# EAGLE design ControllerESP32 (EAGLE 7.7.0)
CNAME: NetStepper; CREVISION: 0.1; DESIGNER: Joël Gähwiler
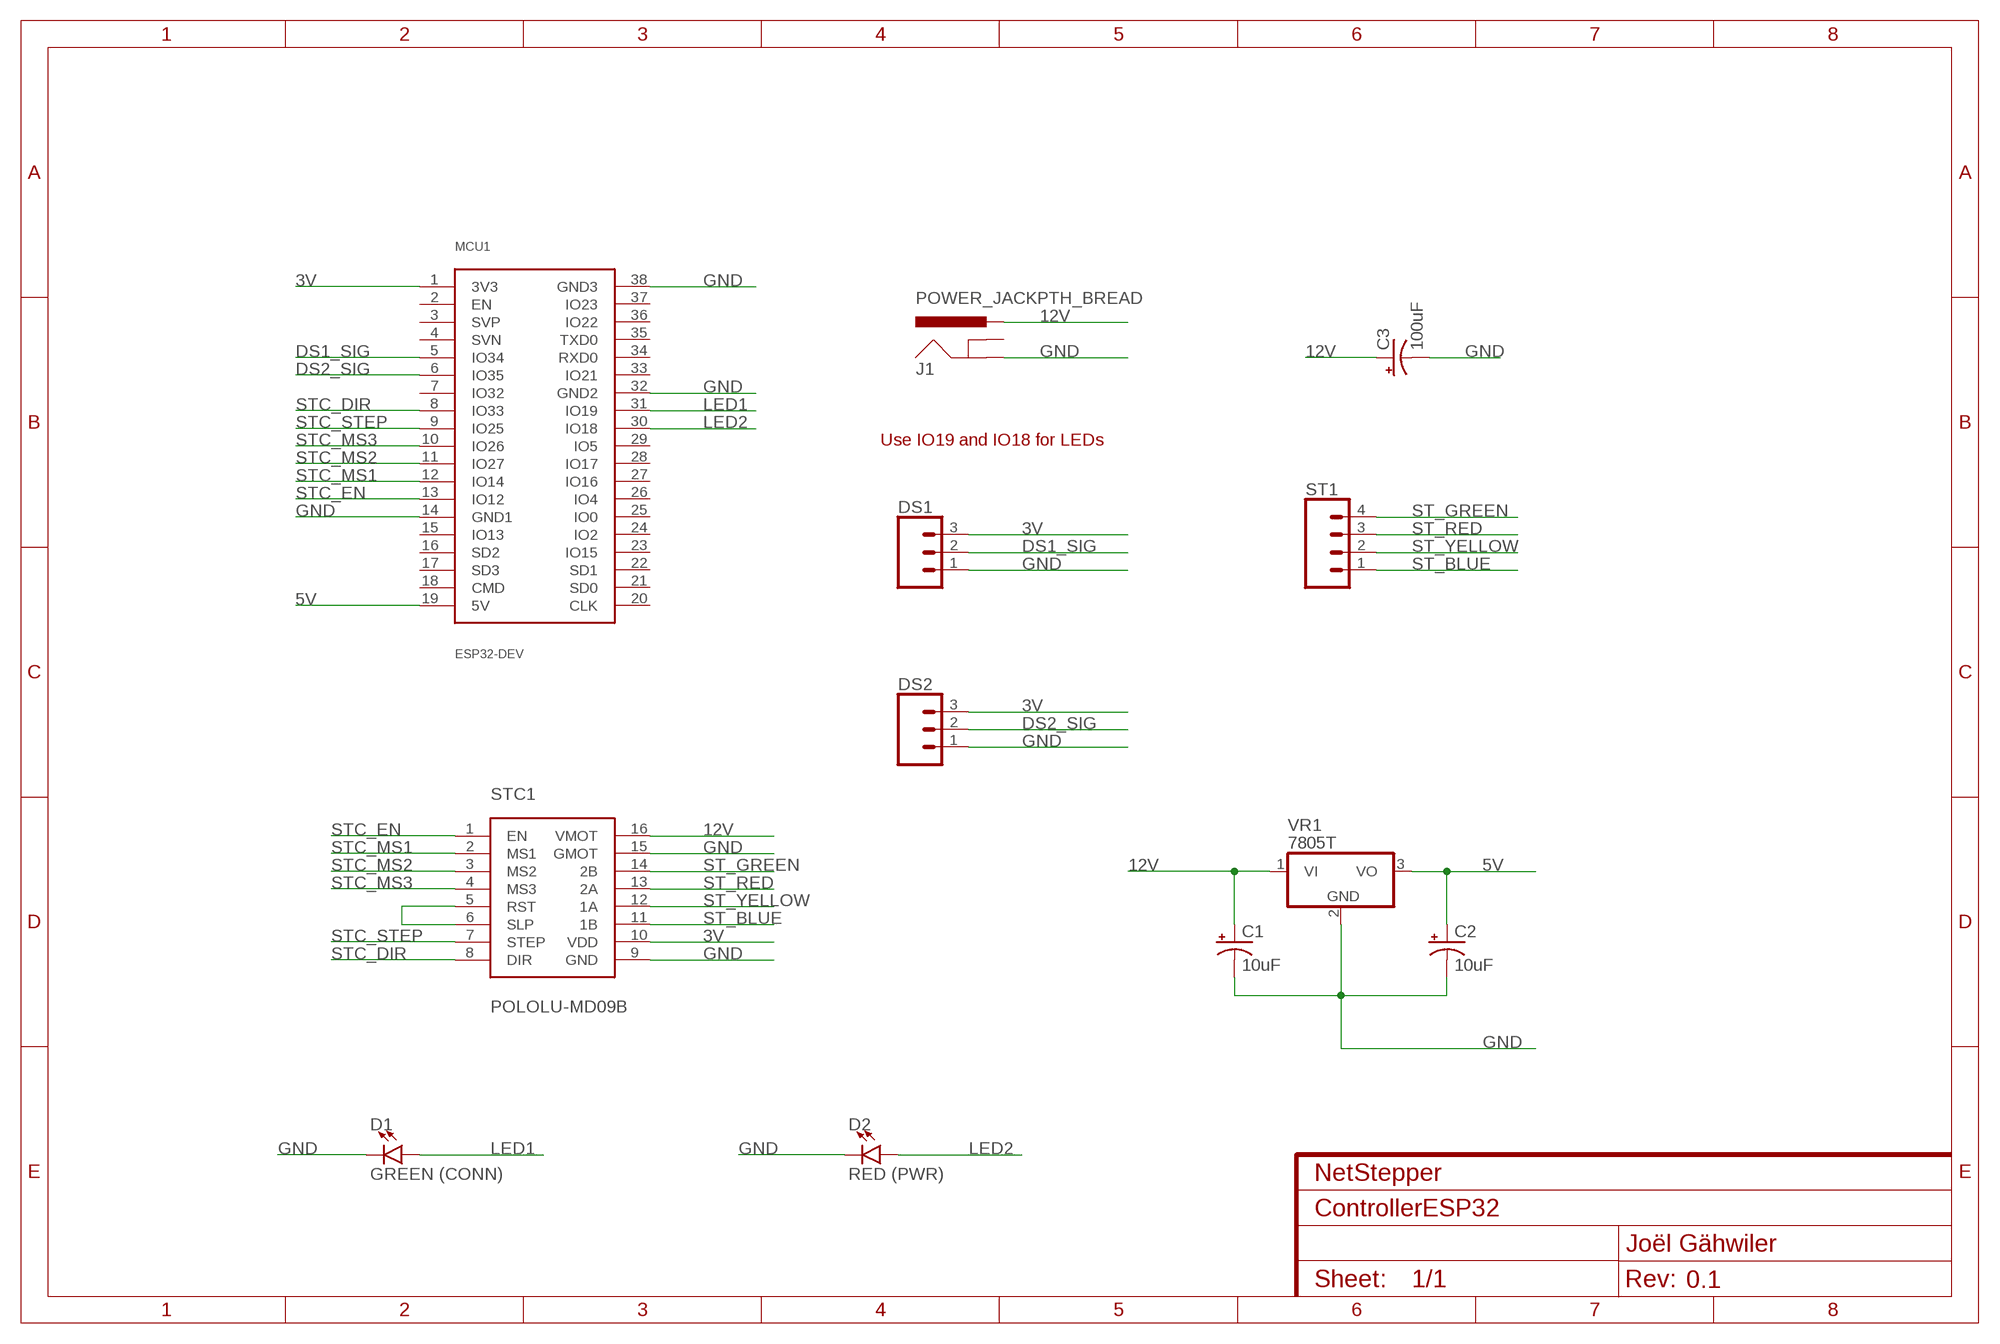
[diagram p0: schematic, sheet 1]

## Parts
C1  10uF  CPOL-USE2-5  [E2-5]
C2  10uF  CPOL-USE2-5  [E2-5]
C3  100uF  CPOL-USE2-5  [E2-5]
D1  GREEN (CONN)  LED5MM  [LED_5MM]
D2  RED (PWR)  LED5MM  [LED_5MM]
DS1  CONN_03LONGPADS  [1X03_LONGPADS]
DS2  CONN_03LONGPADS  [1X03_LONGPADS]
J1  POWER_JACKPTH_BREAD  [POWER_JACK_PTH_BREAD]
MCU1  ESP32-DEV  [ESP32-DEV]
ST1  CONN_04LONGPADS  [1X04_LONGPADS]
STC1  POLOLU-MD09B  [POLOLU-MD09B]
VR1  7805T  [TO220H]

## Nets
3V: DS1.3 DS2.3 MCU1.1(3V3) STC1.10(VDD)
5V: C2.+ MCU1.19(5V) VR1.3(VO)
12V: C1.+ C3.+ J1.PWR STC1.16(VMOT) VR1.1(VI)
DS1_SIG: DS1.2 MCU1.5(IO34)
DS2_SIG: DS2.2 MCU1.6(IO35)
GND: C1.- C2.- C3.- D1.K(C) D2.K(C) DS1.1 DS2.1 J1.GND MCU1.14(GND1) MCU1.32(GND2) MCU1.38(GND3) STC1.9(GND) STC1.15(GMOT) VR1.2(GND)
LED1: D1.A MCU1.31(IO19)
LED2: D2.A MCU1.30(IO18)
N$1: STC1.5(RST) STC1.6(SLP)
ST_BLUE: ST1.1 STC1.11(1B)
ST_GREEN: ST1.4 STC1.14(2B)
ST_RED: ST1.3 STC1.13(2A)
ST_YELLOW: ST1.2 STC1.12(1A)
STC_DIR: MCU1.8(IO33) STC1.8(DIR)
STC_EN: MCU1.13(IO12) STC1.1(EN)
STC_MS1: MCU1.12(IO14) STC1.2(MS1)
STC_MS2: MCU1.11(IO27) STC1.3(MS2)
STC_MS3: MCU1.10(IO26) STC1.4(MS3)
STC_STEP: MCU1.9(IO25) STC1.7(STEP)
Unconnected: J1.GNDBREAK MCU1.2(EN) MCU1.3(SVP) MCU1.4(SVN) MCU1.7(IO32) MCU1.15(IO13) MCU1.16(SD2) MCU1.17(SD3) MCU1.18(CMD) MCU1.20(CLK) MCU1.21(SD0) MCU1.22(SD1) MCU1.23(IO15) MCU1.24(IO2) MCU1.25(IO0) MCU1.26(IO4) MCU1.27(IO16) MCU1.28(IO17) MCU1.29(IO5) MCU1.33(IO21) MCU1.34(RXD0) MCU1.35(TXD0) MCU1.36(IO22) MCU1.37(IO23)

## Notes on the sheet
- Use IO19 and IO18 for LEDs

## Library data of the parts
C1-C3 = adafruit:CPOL-US: POLARIZED CAPACITOR, American symbol
D1 D2 = SparkFun-LED:LED: LED (Generic) Standard schematic elements and footprints for 5mm, 3mm, 1206, and 0603 sized LEDs. Generic LEDs with no color specified.
DS1 DS2 = SparkFun-Connectors:CONN_03: Multi connection point. Often used as Generic Header-pin footprint for 0.1 inch spaced/style header connections On any of the 0.1 inch spaced packages, you can populate with these: Break Away Headers - Straight <https://www.sparkfun.com/products/116> (PRT-00116) Break Away Male Headers - Right Angle <https://www.sparkfun.com/products/553> (PRT-00553) Female Headers <https://www.sparkfun.com/products/115> (PRT-00115) Break Away Headers - Machine Pin <https://www.sparkfun.com/products/117> (PRT-00117) Break Away Female Headers - Swiss Machine Pin <https://www.sparkfun.com/products/743> (PRT-00743) Stackable Header - 3 Pin (Female, 0.1") <https://www.sparkfun.com/products/13875> (PRT-13875) For SCREWTERMINALS and SPRING TERMINALS visit here: Screw Terimnals on SparkFun.com <https://www.sparkfun.com/search/results?term=Screw+Terminals> (5mm/3.5mm/2.54mm spacing) This device is also useful as a general connection point to wire up your design to another part of your project. Our various solder wires solder well into these plated through hole pads. Hook-Up Wire - Assortment (Stranded, 22 AWG) <https://www.sparkfun.com/products/11375> (PRT-11375) Hook-Up Wire - Assortment (Solid Core, 22 AWG) <https://www.sparkfun.com/products/11367> (PRT-11367) View the entire wire category on our website here <https://www.sparkfun.com/categories/141> Special notes: Molex polarized connector foot print use with SKU : PRT-08232 with associated crimp pins and housings.
J1 = SparkFun-Connectors:POWER_JACK: Power Jack Connector This is the standard 5.5mm barrel jack for power. The PTH is the most common, proven, reliable, footprint. The Slot footprint only works if the mill layer is transmitted to the PCB fab house so be warned. Here are the connectors we sell at SparkFun: DC Barrel Power Jack/Connector <https://www.sparkfun.com/products/119> (PRT-00119) DC Barrel Power Jack/Connector (SMD) <https://www.sparkfun.com/products/12748> (PRT-12748) DC Barrel Jack Adapter - Breadboard Compatible <https://www.sparkfun.com/products/10811> (PRT-10811) It is used on this SparkFun product (and many, many others): SparkFun RedBoard - Programmed with Arduino <https://www.sparkfun.com/products/12757> (DEV-12757) Also, if you need a mating power supply or connector, please check these out: Wall Adapter Power Supply - 9VDC 650mA <https://www.sparkfun.com/products/298> (TOL-00298) DC Barrel Jack Adapter - Male <https://www.sparkfun.com/products/10287> (PRT-10287); PROD_ID: PRT-10811
MCU1 = IAD-Library:ESP32-DEV: Adafruit ESP32 Development Board.
ST1 = SparkFun-Connectors:CONN_04: Multi connection point. Often used as Generic Header-pin footprint for 0.1 inch spaced/style header connections On any of the 0.1 inch spaced packages, you can populate with these: Break Away Headers - Straight <https://www.sparkfun.com/products/116> (PRT-00116) Break Away Male Headers - Right Angle <https://www.sparkfun.com/products/553> (PRT-00553) Female Headers <https://www.sparkfun.com/products/115> (PRT-00115) Break Away Headers - Machine Pin <https://www.sparkfun.com/products/117> (PRT-00117) Break Away Female Headers - Swiss Machine Pin <https://www.sparkfun.com/products/743> (PRT-00743) For SCREWTERMINALS and SPRING TERMINALS visit here: Screw Terimnals on SparkFun.com <https://www.sparkfun.com/search/results?term=Screw+Terminals> (5mm/3.5mm/2.54mm spacing) This device is also useful as a general connection point to wire up your design to another part of your project. Our various solder wires solder well into these plated through hole pads. Hook-Up Wire - Assortment (Stranded, 22 AWG) <https://www.sparkfun.com/products/11375> (PRT-11375) Hook-Up Wire - Assortment (Solid Core, 22 AWG) <https://www.sparkfun.com/products/11367> (PRT-11367) View the entire wire category on our website here <https://www.sparkfun.com/categories/141> Special notes: Molex polarized connector foot print use with SKU : PRT-08231 with associated crimp pins and housings. 1MM SMD Version SKU: PRT-10208; PROD_ID: CONN-09696
STC1 = Library:POLOLU-MD09B: The Pololu MD09B stepper controller.
VR1 = adafruit:78*: Positive VOLTAGE REGULATOR Added bigger pads to the TO-92 package

## Board
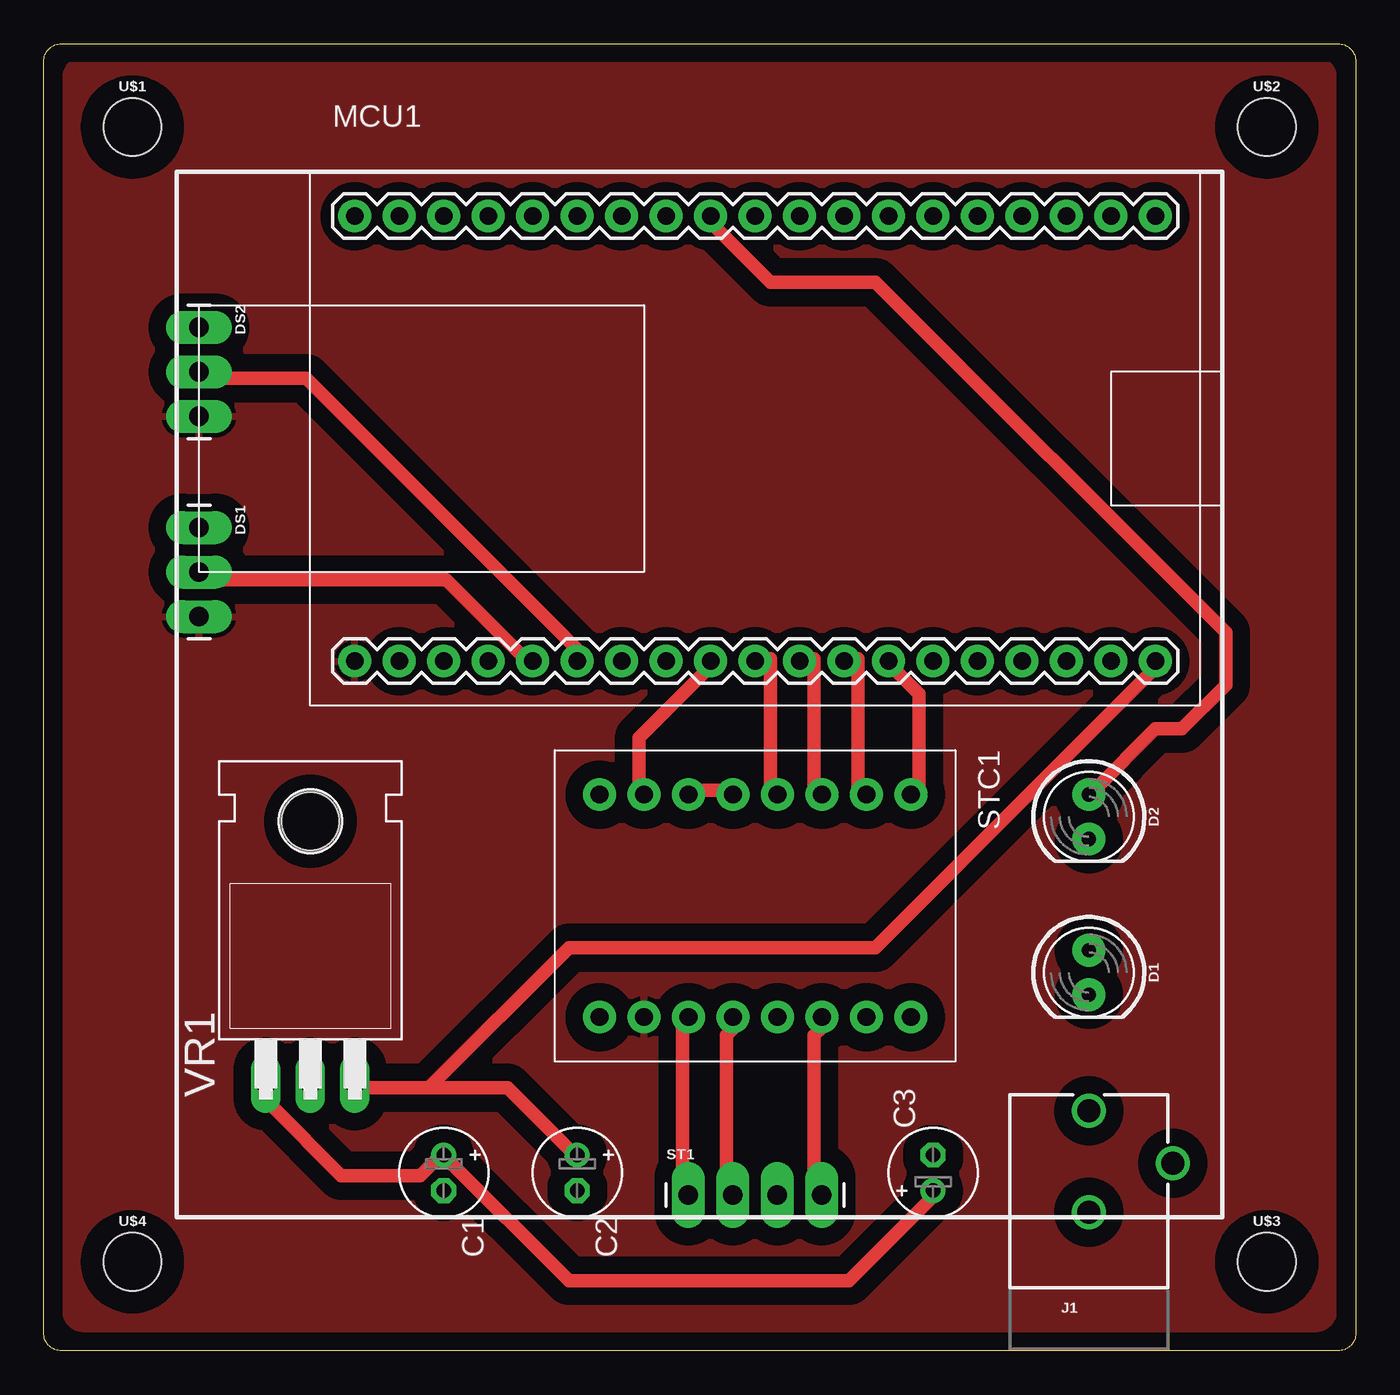
[diagram p1: board, top side]
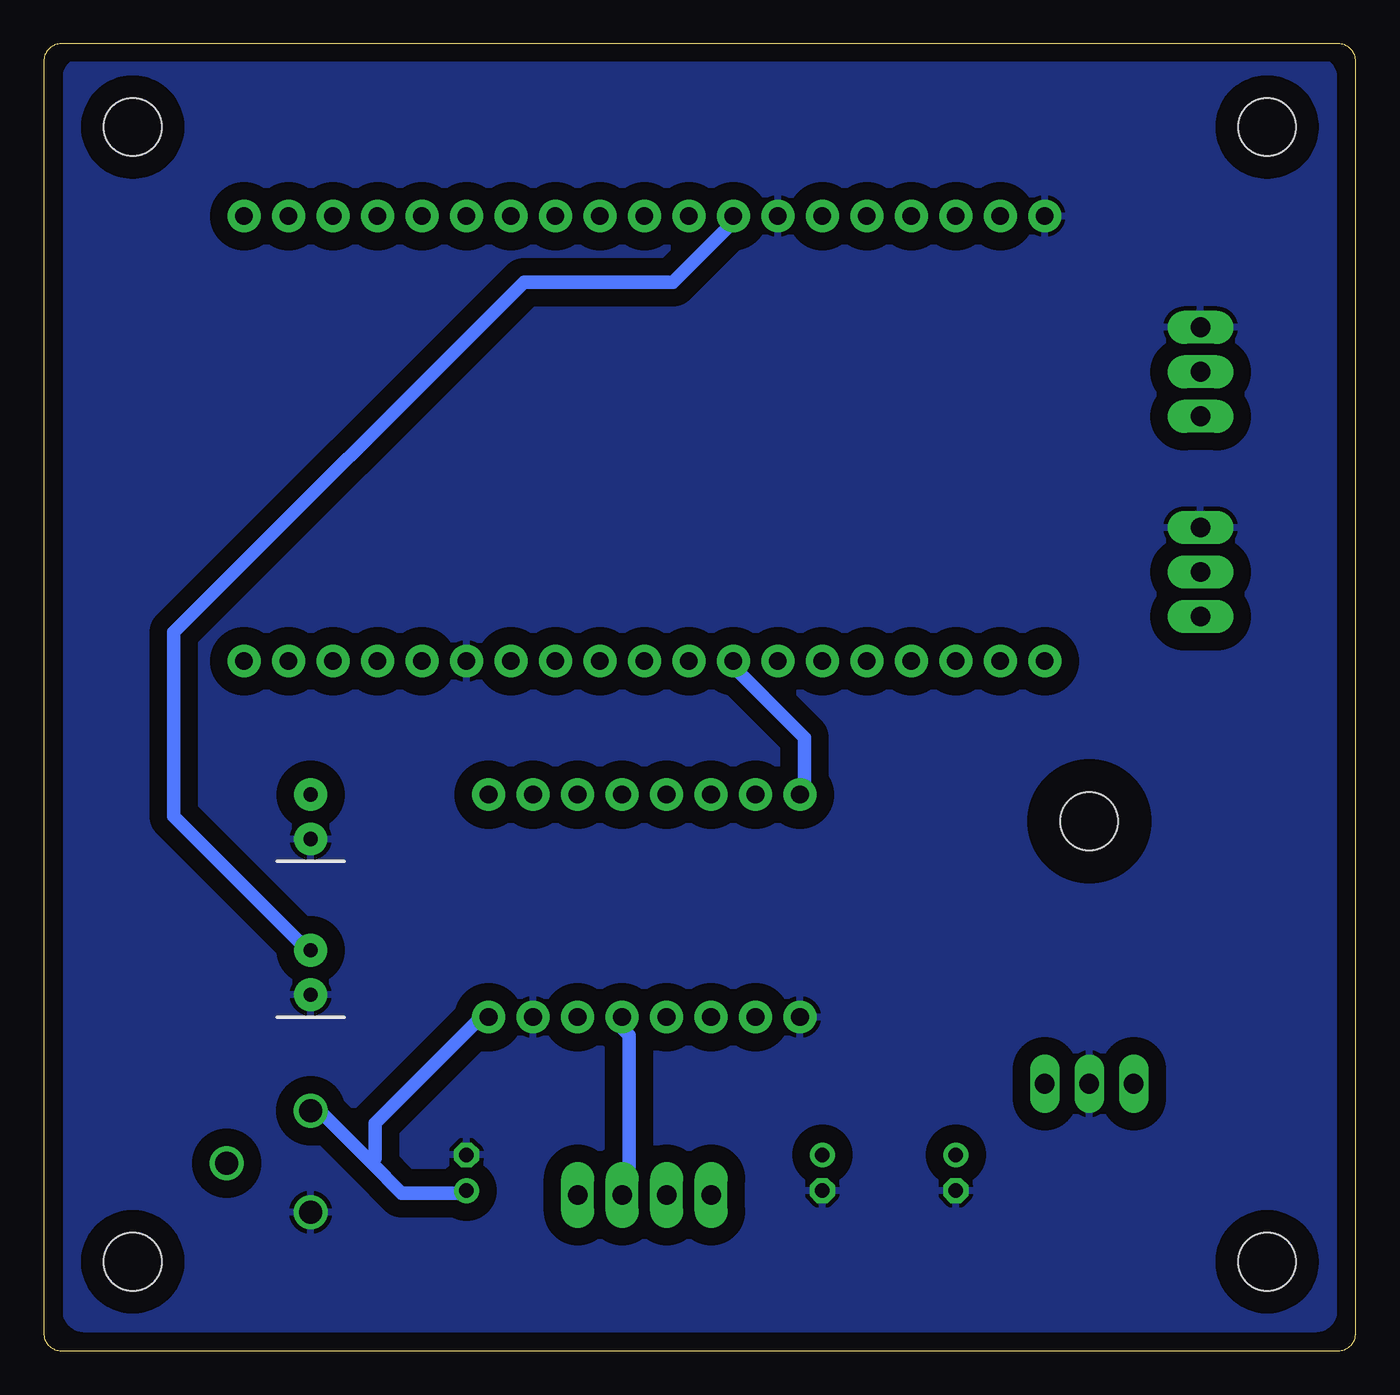
[diagram p2: board, bottom side, seen from below]

Size 74.91 x 74.6 mm. Coordinates in mm from the lower left corner, seen from the top.
Outline: 74.91,73.6 74.91,1 arc-90 73.91,0 1,0 arc-90 0,1 0,73.6 arc-90 1,74.6 73.91,74.6 arc-90 74.91,73.6
Copper layers (1*16): Top 0.035mm / dielectric 1.5mm / Bottom 0.035mm
Design rules "SparkFun-2-layer-STANDARD *": minimum track width 30mil, minimum drill 20mil, track to track 10mil, track to pad 10mil, pad to pad 10mil, via to via 10mil, smd to smd 8mil, copper to edge 8mil, drill to drill 8mil, minimum pad ring 10mil, minimum via ring 10mil, stop-mask expansion 4mil, vias tented up to drill 25mil, thermal gap 10mil

### Footprints (pad centres in the part's own frame; a part is rotated, then mirrored left to right if it is on the bottom)
E2-5 = drill 0.813 pad 1.422: + -1.016,0 | drill 0.813 pad 1.422 octagon: - 1.016,0
LED_5MM = drill 0.813 pad 1.88: A -1.27,0; K 1.27,0
1X03_LONGPADS = drill 1.118 pad 1.88 long: 1 0,0; 2 2.54,0; 3 5.08,0
POWER_JACK_PTH_BREAD = drill 1.3: GND 0,7.9; GNDBREAK 4.8,10.7; PWR 0,13.7
ESP32-DEV = drill 1.016 pad 1.88: 1 -22.86,-12.7; 2 -20.32,-12.7; 3 -17.78,-12.7; 4 -15.24,-12.7; 5 -12.7,-12.7; 6 -10.16,-12.7; 7 -7.62,-12.7; 8 -5.08,-12.7; 9 -2.54,-12.7; 10 0,-12.7; 11 2.54,-12.7; 12 5.08,-12.7; 13 7.62,-12.7; 14 10.16,-12.7; 15 12.7,-12.7; 16 15.24,-12.7; 17 17.78,-12.7; 18 20.32,-12.7; 19 22.86,-12.7; 20 22.86,12.7; 21 20.32,12.7; 22 17.78,12.7; 23 15.24,12.7; 24 12.7,12.7; 25 10.16,12.7; 26 7.62,12.7; 27 5.08,12.7; 28 2.54,12.7; 29 0,12.7; 30 -2.54,12.7; 31 -5.08,12.7; 32 -7.62,12.7; 33 -10.16,12.7; 34 -12.7,12.7; 35 -15.24,12.7; 36 -17.78,12.7; 37 -20.32,12.7; 38 -22.86,12.7
1X04_LONGPADS = drill 1.118 pad 1.88 long: 1 0,0; 2 2.54,0; 3 5.08,0; 4 7.62,0
POLOLU-MD09B = drill 1.016 pad 1.88: 1 -6.35,8.89; 2 -6.35,6.35; 3 -6.35,3.81; 4 -6.35,1.27; 5 -6.35,-1.27; 6 -6.35,-3.81; 7 -6.35,-6.35; 8 -6.35,-8.89; 9 6.35,-8.89; 10 6.35,-6.35; 11 6.35,-3.81; 12 6.35,-1.27; 13 6.35,1.27; 14 6.35,3.81; 15 6.35,6.35; 16 6.35,8.89
STAND-OFF = hole 3.302: 0,0
TO220H = drill 1.118 long: 1 -2.54,-10.16; 2 0,-10.16; 3 2.54,-10.16 | hole 3.302: 0,4.826

### Placement (x,y rotation side)
C1  22.84,10.16 270 top
C2  30.46,10.16 270 top
C3  50.78,10.16 90 top
D1  59.67,21.59 270 top
D2  59.67,30.48 270 top
DS1  8.87,46.99 270 top
DS2  8.87,58.42 270 top
J1  59.67,0 0 top
MCU1  40.62,52.07 0 top
ST1  36.81,8.89 0 top
STC1  40.62,25.4 270 top
U$1  [STAND-OFF]  5.06,69.85 0 top
U$2  [STAND-OFF]  69.83,69.85 0 top
U$3  [STAND-OFF]  69.83,5.08 0 top
U$4  [STAND-OFF]  5.06,5.08 0 top
VR1  15.22,25.4 0 top

### Tracks (layer width: path | path; a pad name or v marks a point on that pad's centre or on a via)
3V
  pour Top (isolate 1): 1.25,72.66 1.25,2.27 arc90 2.25,1.27 72.64,1.27 arc90 73.64,2.27 73.64,72.66 arc90 72.64,73.66 2.25,73.66 arc90
5V
  Top 0.762: 21.98,15 17.98,15 VR1.3 | 21.98,15 26.48,15 29.98,11.5 C2.+ | 21.98,15 29.98,23 47.48,23 63.48,39 MCU1.19
12V
  Top 0.762: VR1.1 12.98,15 12.98,14 16.98,10 21.48,10 22.48,11 C1.+ 22.98,11 29.98,4 45.98,4 50.98,9 C3.+
  Bottom 0.762: 56.23,10.75 59.48,14 J1.PWR | 56.23,10.75 54.48,9 50.98,9 C3.+ | STC1.16 49.98,19 55.98,13 55.98,11 56.23,10.75
DS1_SIG
  Top 0.762: DS1.2 8.98,44 22.98,44 27.48,39.5 MCU1.5
DS2_SIG
  Top 0.762: DS2.2 8.98,55.5 14.98,55.5 30.98,39.5 30.48,39 MCU1.6
GND
  pour Bottom (isolate 1): 2.25,73.66 72.64,73.66 arc-90 73.64,72.66 73.64,2.27 arc-90 72.64,1.27 2.25,1.27 arc-90 1.25,2.27 1.25,72.66 arc-90
LED1
  Bottom 0.762: D1.A 59.98,23 67.48,30.5 67.48,41 47.48,61 38.98,61 35.48,64.5 MCU1.31
LED2
  Top 0.762: D2.A 59.98,32 63.48,35.5 64.98,35.5 67.48,38 67.48,41 47.48,61 41.48,61 37.98,64.5 MCU1.30
N$1
  Top 0.762: STC1.6 36.98,32 38.98,32 STC1.5
ST_BLUE
  Top 0.762: ST1.1 36.48,9 36.48,19 STC1.11
ST_GREEN
  Top 0.762: ST1.4 43.98,9 43.98,18 44.48,18.5 44.48,19 STC1.14
ST_RED
  Bottom 0.762: ST1.3 41.48,9 41.48,18 41.98,18.5 41.98,19 STC1.13
ST_YELLOW
  Top 0.762: ST1.2 38.98,9 38.98,18 39.48,18.5 39.48,19 STC1.12
STC_DIR
  Bottom 0.762: STC1.8 31.48,32 31.48,35 35.48,39 MCU1.8
STC_EN
  Top 0.762: STC1.1 49.98,32 49.98,37.5 48.48,39 MCU1.13
STC_MS1
  Top 0.762: STC1.2 46.48,32 46.48,39.5 45.98,39.5 MCU1.12
STC_MS2
  Top 0.762: STC1.3 43.98,32 43.98,39.5 43.48,39.5 MCU1.11
STC_MS3
  Top 0.762: STC1.4 41.48,32 41.48,39.5 40.98,39.5 MCU1.10
STC_STEP
  Top 0.762: STC1.7 33.98,32 33.98,35 37.98,39 MCU1.9